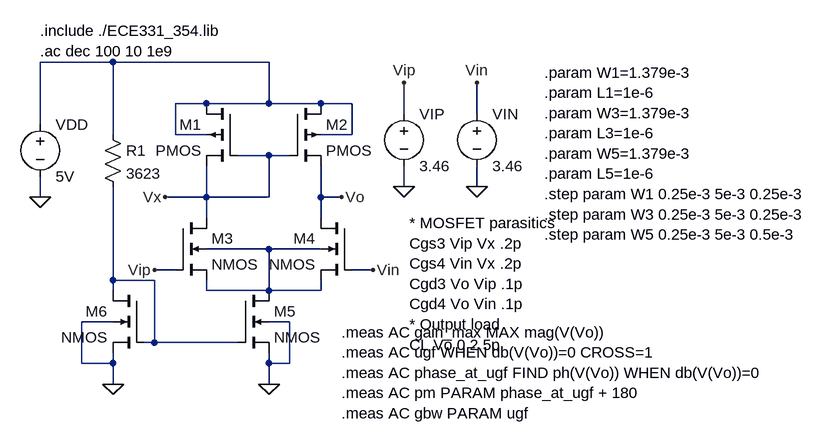
[diagram p0: schematic circuit.asc]
circuit.asc, the LTspice schematic file:
Version 4
SHEET 1 1724 680
WIRE 80 48 -32 48
WIRE 320 48 80 48
WIRE 224 112 176 112
WIRE 320 112 320 48
WIRE 320 112 224 112
WIRE 400 112 320 112
WIRE 448 112 400 112
WIRE 528 128 528 80
WIRE 640 128 640 80
WIRE -32 144 -32 48
WIRE 80 160 80 48
WIRE 176 160 176 112
WIRE 224 160 176 160
WIRE 448 160 448 112
WIRE 448 160 400 160
WIRE 320 192 272 192
WIRE 352 192 320 192
WIRE 528 240 528 208
WIRE 640 240 640 208
WIRE -32 256 -32 224
WIRE 224 256 224 208
WIRE 224 256 160 256
WIRE 320 256 320 192
WIRE 320 256 224 256
WIRE 400 256 400 208
WIRE 432 256 400 256
WIRE 224 288 224 256
WIRE 400 288 400 256
WIRE 320 336 224 336
WIRE 400 336 320 336
WIRE 176 368 144 368
WIRE 480 368 448 368
WIRE 80 384 80 240
WIRE 144 384 80 384
WIRE 80 400 80 384
WIRE 224 400 224 384
WIRE 320 400 320 336
WIRE 320 400 224 400
WIRE 400 400 400 384
WIRE 400 400 320 400
WIRE 80 448 32 448
WIRE 352 448 320 448
WIRE 144 480 144 384
WIRE 144 480 128 480
WIRE 272 480 144 480
WIRE 32 512 32 448
WIRE 80 512 80 496
WIRE 80 512 32 512
WIRE 320 512 320 496
WIRE 352 512 352 448
WIRE 352 512 320 512
WIRE 80 544 80 512
WIRE 320 544 320 512
FLAG 320 544 0
FLAG 80 544 0
FLAG -32 256 0
FLAG 432 256 Vo
FLAG 160 256 Vx
FLAG 528 240 0
FLAG 640 240 0
FLAG 528 80 Vip
FLAG 640 80 Vin
FLAG 144 368 Vip
FLAG 480 368 Vin
SYMBOL voltage -32 128 R0
SYMATTR InstName VDD
SYMATTR Value 5V
SYMBOL Res 64 144 R0
SYMATTR InstName R1
SYMATTR Value 3623
SYMBOL Voltage 528 112 R0
SYMATTR InstName VIP
SYMATTR Value 3.46
SYMATTR Value2 AC 250m
SYMBOL Voltage 640 112 R0
SYMATTR InstName VIN
SYMATTR Value 3.46
SYMATTR Value2 AC -250m
SYMBOL nmos4 176 288 R0
SYMATTR InstName M3
SYMATTR Value2 l={L3} w={W3}
SYMBOL nmos4 448 288 M0
SYMATTR InstName M4
SYMATTR Value2 l={L3} w={W3}
SYMBOL nmos4 272 400 R0
SYMATTR InstName M5
SYMATTR Value2 l={L5} w={W5}
SYMBOL nmos4 128 400 M0
SYMATTR InstName M6
SYMATTR Value2 l={L5} w={W5}
SYMBOL pmos4 352 112 R0
SYMATTR InstName M2
SYMATTR Value2 l={L1} w={W1}
SYMBOL pmos4 272 112 M0
SYMATTR InstName M1
SYMATTR Value2 l={L1} w={W1}
TEXT 744 64 Left 2 !.param W1=1.379e-3\n.param L1=1e-6\n.param W3=1.379e-3\n.param L3=1e-6\n.param W5=1.379e-3\n.param L5=1e-6\n.step param W1 0.25e-3 5e-3 0.25e-3\n.step param W3 0.25e-3 5e-3 0.25e-3\n.step param W5 0.25e-3 5e-3 0.5e-3
TEXT 536 296 Left 2 !* MOSFET parasitics\nCgs3 Vip Vx .2p\nCgs4 Vin Vx .2p\nCgd3 Vo Vip .1p\nCgd4 Vo Vin .1p\n* Output load\nCL Vo 0 2.5p
TEXT -32 0 Left 2 !.include ./ECE331_354.lib\n.ac dec 100 10 1e9
TEXT 432 464 Left 2 !.meas AC gain_max MAX mag(V(Vo))\n.meas AC ugf WHEN db(V(Vo))=0 CROSS=1\n.meas AC phase_at_ugf FIND ph(V(Vo)) WHEN db(V(Vo))=0\n.meas AC pm PARAM phase_at_ugf + 180\n.meas AC gbw PARAM ugf

The netlist it stands for:
* circuit.asc
VDD N001 0 5V
R1 N001 N003 3623
VIP Vip 0 3.46 AC 250m
VIN Vin 0 3.46 AC -250m
M3 Vx Vip N002 N002 NMOS l={L3} w={W3}
M4 Vo Vin N002 N002 NMOS l={L3} w={W3}
M5 N002 N003 0 0 NMOS l={L5} w={W5}
M6 N003 N003 0 0 NMOS l={L5} w={W5}
M2 N001 Vx Vo N001 PMOS l={L1} w={W1}
M1 N001 Vx Vx N001 PMOS l={L1} w={W1}
.model NMOS NMOS
.model PMOS PMOS
.lib standard.mos
.param W1=1.379e-3
.param L1=1e-6
.param W3=1.379e-3
.param L3=1e-6
.param W5=1.379e-3
.param L5=1e-6
.step param W1 0.25e-3 5e-3 0.25e-3
.step param W3 0.25e-3 5e-3 0.25e-3
.step param W5 0.25e-3 5e-3 0.5e-3
* MOSFET parasitics
Cgs3 Vip Vx .2p
Cgs4 Vin Vx .2p
Cgd3 Vo Vip .1p
Cgd4 Vo Vin .1p
* Output load
CL Vo 0 2.5p
.include ./ECE331_354.lib
.ac dec 100 10 1e9
.meas AC gain_max MAX mag(V(Vo))
.meas AC ugf WHEN db(V(Vo))=0 CROSS=1
.meas AC phase_at_ugf FIND ph(V(Vo)) WHEN db(V(Vo))=0
.meas AC pm PARAM phase_at_ugf + 180
.meas AC gbw PARAM ugf
.backanno
.end